# EAGLE design LazuriteMiniDongle3 (EAGLE 7.6.0)
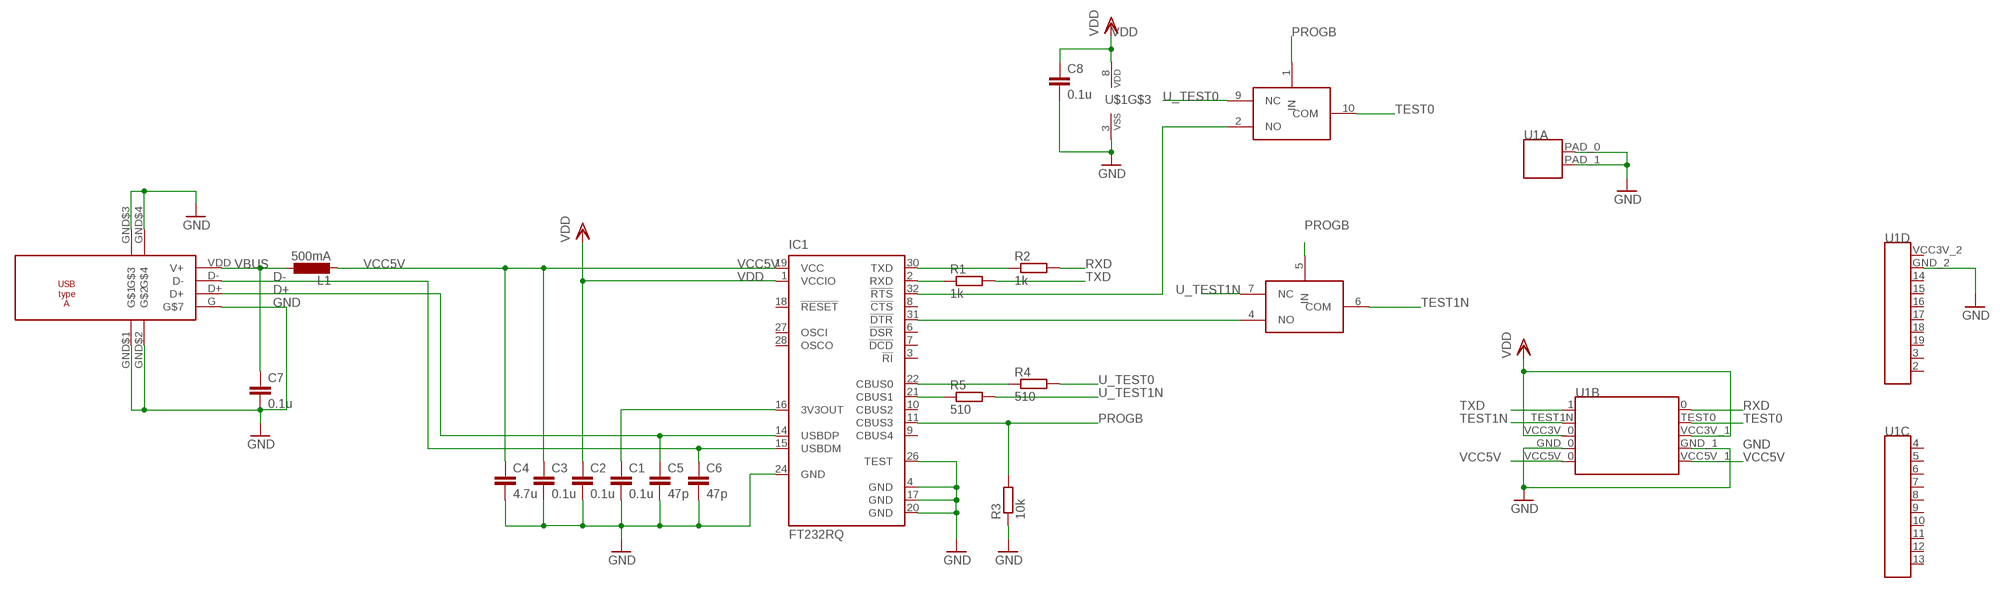
[diagram p0: schematic, sheet 1]

## Parts
C1  0.1u  C-EUC0402  [C0402]
C2  0.1u  C-EUC0402  [C0402]
C3  0.1u  C-EUC0402  [C0402]
C4  4.7u  C-EUC1608  [C1608]
C5  47p  C-EUC0402  [C0402]
C6  47p  C-EUC0402  [C0402]
C7  0.1u  C-EUC0402  [C0402]
C8  0.1u  C-EUC0402  [C0402]
IC1  FT232RQ  [QFN32]
L1  500mA  L-EUL1812  [L1812]
R1  1k  R-EU_R0402  [R0402]
R2  1k  R-EU_R0402  [R0402]
R3  10k  R-EU_R0402  [R0402]
R4  510  R-EU_R0402  [R0402]
R5  510  R-EU_R0402  [R0402]
U1  LAZURITE920JLAZURITE920J  [LAZURITE920J]
U$1  TI-TS5A23159  [UQFN10]
U$2  USB-TYPE-A  [UP2-AH-TH]

## Nets
D+: C5.1 IC1.14(USBDP) U$2.D+
D-: C6.1 IC1.15(USBDM) U$2.D-
GND: C1.2 C2.2 C3.2 C4.2 C5.2 C6.2 C7.2 C8.2 IC1.4(GND) IC1.17(GND) IC1.20(GND) IC1.24(GND) IC1.26(TEST) R3.1 U1.GND_0(B:GND_0) U1.GND_1(B:GND_1) U1.GND_2(D:GND_2) U1.PAD_0(A:PAD_0) U1.PAD_1(A:PAD_1) U$1.3(VSS) U$2.G(G$7) U$2.GND$1(G$1) U$2.GND$2(G$2) U$2.GND$3(G$3) U$2.GND$4(G$4)
N$1: C1.1 IC1.16(3V3OUT)
N$3: IC1.32(!RTS) U$1.2(NO)
N$5: IC1.2(RXD) R1.1
N$6: IC1.30(TXD) R2.1
N$7: IC1.21(CBUS1) R5.1
N$8: IC1.22(CBUS0) R4.1
N$9: IC1.31(!DTR) U$1.4(NO)
PROGB: IC1.11(CBUS3) R3.2 U$1.1(IN) U$1.5(IN)
RXD: R2.2 U1.0
TEST0: U1.TEST0(B:TEST0) U$1.10(COM)
TEST1N: U1.TEST1N(B:TEST1N) U$1.6(COM)
TXD: R1.2 U1.1
U_TEST0: R4.2 U$1.9(NC)
U_TEST1N: R5.2 U$1.7(NC)
VBUS: C7.1 L1.1 U$2.VDD(V+)
VCC5V: C3.1 C4.1 IC1.19(VCC) L1.2 U1.VCC5V_0(B:VCC5V_0) U1.VCC5V_1(B:VCC5V_1)
VDD: C2.1 C8.1 IC1.1(VCCIO) U1.VCC3V_0(B:VCC3V_0) U1.VCC3V_1(B:VCC3V_1) U$1.8(VDD)
Unconnected: IC1.3(!RI) IC1.6(!DSR) IC1.7(!DCD) IC1.8(!CTS) IC1.9(CBUS4) IC1.10(CBUS2) IC1.18(!RESET) IC1.27(OSCI) IC1.28(OSCO) U1.2 U1.3 U1.4 U1.5 U1.6 U1.7 U1.8 U1.9 U1.10 U1.11 U1.12 U1.13 U1.14 U1.15 U1.16 U1.17 U1.18 U1.19 U1.VCC3V_2(D:VCC3V_2)

## Library data of the parts
C1-C3 C5-C8 = rcl:C-EU: CAPACITOR, European symbol
C4 = resistor:C-EU: CAPACITOR, European symbol
IC1 = ftdichip:FT232R: Source: http://www.ftdichip.com/Documents/DataSheets/DS_FT232R_v104.pdf; MPN: FT232RQ; OC_FARNELL: 1146033; OC_NEWARK: 91K9919
L1 = rcl:L-EU: INDUCTOR, European symbol
R1-R5 = rcl:R-EU_: RESISTOR, European symbol
U1 = lazurite:LAZURITE920J: Lazurite 920J
U$1 = lz-shield:TI-TS5A23159
U$2 = lz-shield:USB-TYPE-A

## Board
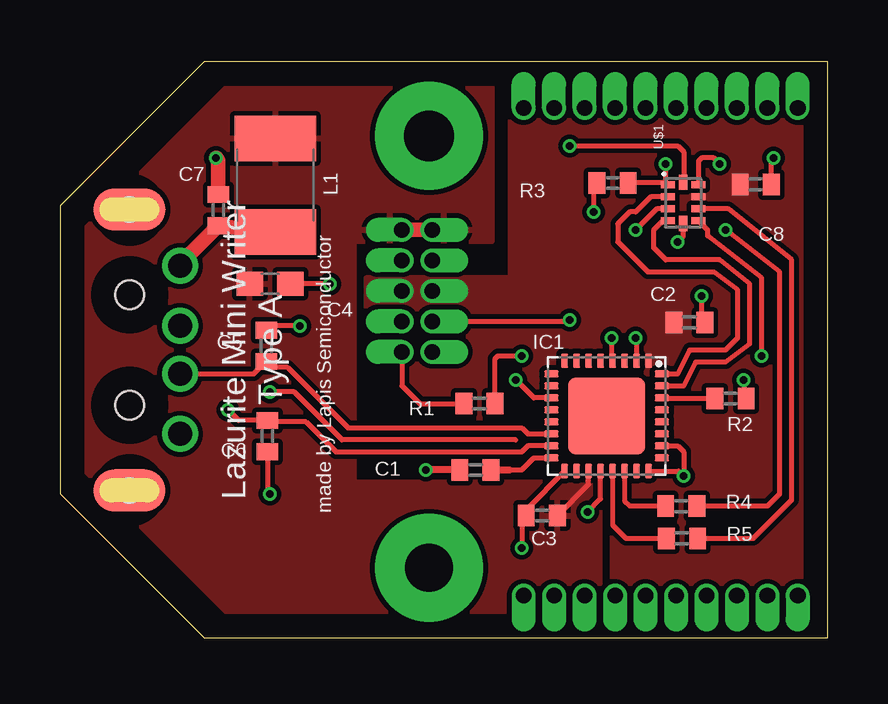
[diagram p1: board, top side]
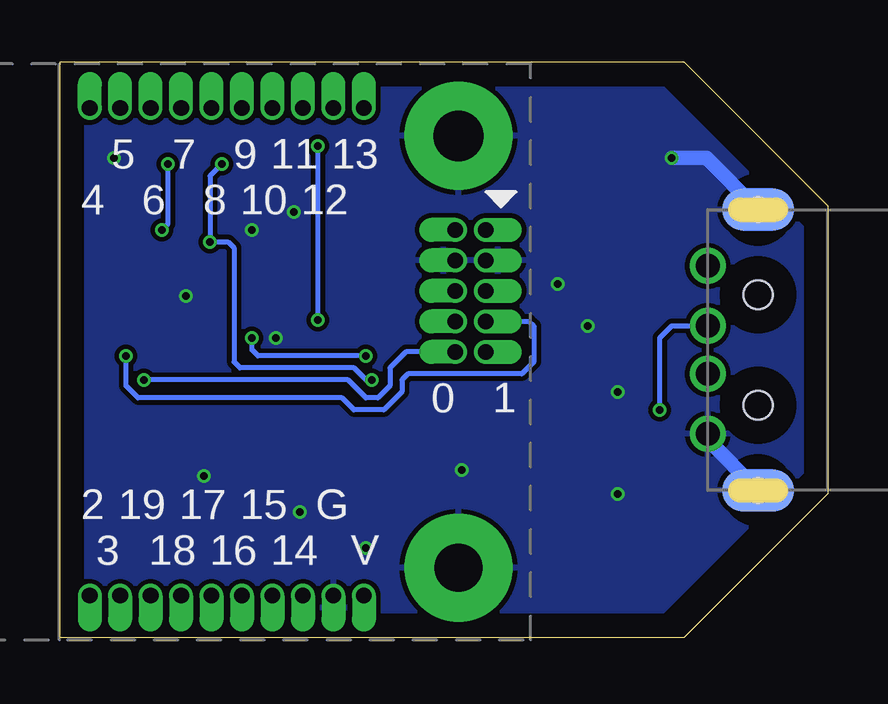
[diagram p2: board, bottom side, seen from below]

Size 32 x 24 mm. Coordinates in mm from the lower left corner, seen from the top.
Outline: 6,0 32,0 32,24 6,24 0,18 0,6 6,0
Copper layers (1*16): Top 0.018mm / dielectric 1.55mm / Bottom 0.018mm
Design rules "kpl_2_layer *": minimum track width 0.2mm, minimum drill 0.3mm, track to track 0.2mm, track to pad 0.2mm, pad to pad 0.2mm, via to via 0.2mm, smd to smd 0mil, copper to edge 1mm, drill to drill 0.3mm, minimum pad ring 0.175mm, minimum via ring 0.125mm, stop-mask expansion 0mil, vias tented up to drill 0.45mm, thermal gap 0.2mm

### Footprints (pad centres in the part's own frame; a part is rotated, then mirrored left to right if it is on the bottom)
C0402 = smd 0.7 x 0.9: 1 -0.65,0; 2 0.65,0
C1608 = smd 1.1 x 1: 1 -0.85,0; 2 0.85,0
QFN32 = smd 0.6 x 0.3: 1 -2.3,1.75; 2 -2.3,1.25; 3 -2.3,0.75; 4 -2.3,0.25; 5 -2.3,-0.25; 6 -2.3,-0.75; 7 -2.3,-1.25; 8 -2.3,-1.75; 17 2.3,-1.75; 18 2.3,-1.25; 19 2.3,-0.75; 20 2.3,-0.25; 21 2.3,0.25; 22 2.3,0.75; 23 2.3,1.25; 24 2.3,1.75 | smd 0.3 x 0.6: 9 -1.75,-2.3; 10 -1.25,-2.3; 11 -0.75,-2.3; 12 -0.25,-2.3; 13 0.25,-2.3; 14 0.75,-2.3; 15 1.25,-2.3; 16 1.75,-2.3; 25 1.75,2.3; 26 1.25,2.3; 27 0.75,2.3; 28 0.25,2.3; 29 -0.25,2.3; 30 -0.75,2.3; 31 -1.25,2.3; 32 -1.75,2.3 | smd 3.2 x 3.2: EXP 0,0
L1812 = smd 1.9 x 3.4: 1 -1.95,0; 2 1.95,0
R0402 = smd 0.7 x 0.9: 1 -0.65,0; 2 0.65,0
LAZURITE920J = drill 0.65 pad 0.8 offset: 0 1.27,5.08; 1 0,5.08; 2 16.51,15.24; 3 15.24,15.24; 4 16.51,-5.08; 5 15.24,-5.08; 6 13.97,-5.08; 7 12.7,-5.08; 8 11.43,-5.08; 9 10.16,-5.08; 10 8.89,-5.08; 11 7.62,-5.08; 12 6.35,-5.08; 13 5.08,-5.08; 14 7.62,15.24; 15 8.89,15.24; 16 10.16,15.24; 17 11.43,15.24; 18 12.7,15.24; 19 13.97,15.24; GND_0 0,1.27; GND_1 1.27,1.27; GND_2 6.35,15.24; TEST0 1.27,3.81; TEST1N 0,3.81; VCC3V_0 0,2.54; VCC3V_1 1.27,2.54; VCC3V_2 5.08,15.24; VCC5V_0 0,0; VCC5V_1 1.27,0 | drill 2.1 pad 4.5: PAD_0 1.135,-3.92 | drill 2 pad 4.5: PAD_1 1.135,14.08
UQFN10 = smd 0.3 x 0.58: 1 -0.75,-0.635; 2 -0.25,-0.635; 3 0.25,-0.635; 4 0.75,-0.635; 6 0.75,0.635; 7 0.25,0.635; 8 -0.25,0.635; 9 -0.75,0.635 | smd 0.63 x 0.35: 5 0.86,0; 10 -0.86,0
UP2-AH-TH = drill 1: D+ -1,5; D- 1,5; G -3.5,5; VDD 3.5,5 | smd 1.75 x 3: GND$1 -5.85,2.9; GND$4 5.85,2.9 | smd 1.75 x 3 bottom: GND$2 -5.85,2.9; GND$3 5.85,2.9 | hole 1.2: -2.3,2.9; 2.3,2.9 | hole 1: -5.85,2.9; 5.85,2.9

### Placement (x,y rotation side)
C1  17.32,7 180 top
C2  26.24,13.15 0 top
C3  20.09,5.1 180 top
C4  8.76,14.75 0 top
C5  8.6,12.17 90 top
C6  8.65,8.41 270 top
C7  6.6,17.83 90 top
C8  29,18.9 0 top
IC1  22.79,9.25 270 top
L1  8.98,18.86 90 top
R1  17.49,9.77 180 top
R2  27.95,9.98 0 top
R3  23.04,18.96 0 top
R4  25.9,5.49 0 top
R5  25.93,4.15 0 top
U1  14.25,17 180 bottom
U$1  25.98,18.13 270 top
U$2  0,12 90 bottom

### Tracks (layer width: path | path; a pad name or v marks a point on that pad's centre or on a via)
D+
  Top 0.2: U$2.D+ 8.08,11 C5.1 8.6,11.27 9.48,11.27 12,8.75 19.25,8.75 19.5,8.5 IC1.14
D-  (via drill 0.3)
  Top 0.2: v7,9.5 7.44,9.06 C6.1 8.71,9 10.25,9 11.5,7.75 19.25,7.75 19.5,8 IC1.15
  Bottom 0.2: v7,9.5 7,12.5 6.5,13 U$2.D-
GND  (via drill 0.3)  (2 unrouted)
  Top 0.2: v11.25,14.75 C4.2 | v10,13 8.78,13 C5.2 | C6.2 8.65,6.1 v8.75,6 | C8.2 29.65,19.9 v29.75,20 | U$1.3 24.88,17.88 v24,17 | v22.25,17.75 22.25,18.82 R3.1 | IC1.4 23,11.59 v23,12.5 | 21,6.91 IC1.17 19.44,5.35 C3.2 19.25,4.91 v19.25,3.75 | IC1.24 25.8,6.95 v26,6.75 26,7.75 25.75,8 IC1.26 | C2.2 26.75,13.29 v26.75,14.25 | 19,8.25 11.75,8.25 9.75,10.25 v8.75,10.25 | v22,5.25 22.54,5.79 IC1.20
  Top 0.3: C1.2 v15.25,7
  Top 0.6: C7.2 6.6,19.9 v6.5,20
  Bottom 0.6: U$2.GND$2 5,8.25 U$2.G | U$2.GND$4 5.05,20 v6.5,20
  pour Bottom: 7,1 31,1 31,23 7,23 1,17 1,7
N$1
  Top 0.2: 18.75,7 19.25,7 19.75,7.5 IC1.16
  Top 0.3: C1.1 18.75,7
N$3
  Top 0.2: IC1.32 25.75,11 26.25,12 27.75,12 28.25,12.5 28.25,14.5 27.25,15.25 24.5,15.25 23.25,16.5 23.25,17.25 23.75,17.75 24,17.75 24.63,18.38 U$1.2
N$5  (via drill 0.3)
  Top 0.2: v24,12.5 24.04,12.46 IC1.2 | R1.1 18.14,11.64 18.25,11.75 v19.25,11.75
  Bottom 0.2: v19.25,11.75 23.75,11.75 24,12 v24,12.5
N$6
  Top 0.2: IC1.30 25.11,9.98 R2.1
N$7
  Top 0.2: IC1.21 23.04,4.71 23.6,4.15 R5.1
N$8
  Top 0.2: IC1.22 23.54,5.71 23.75,5.5 R4.1
N$9
  Top 0.2: IC1.31 26,10.5 26.5,11.5 27.75,11.5 28.75,12.25 28.75,14.75 27.5,15.75 25.25,15.75 24.75,16.25 24.75,17 25.13,17.38 U$1.4
PROGB  (via drill 0.3)
  Top 0.2: v25.75,16.5 25.98,16.73 U$1.5 | R3.2 25.27,18.96 U$1.1 25.25,18.98 v25.25,19.75 | IC1.11 19.75,10 v19,10.75
  Bottom 0.2: v25.25,19.75 25.75,19.25 v25.75,16.5 25,16.5 24.75,16.25 24.75,11.5 24.5,11.25 19.75,11.25 19.25,10.75 v19,10.75
RXD  (via drill 0.3)
  Top 0.2: v28.5,10.75 28.5,10.08 R2.2
  Bottom 0.2: U1.0 17.58,11.92 18.25,11.25 18.25,10.5 18.75,10 19.25,10 20,10.75 v28.5,10.75
TEST0  (via drill 0.3)
  Top 0.2: v21.25,20.5 25.75,20.5 26,20.25 26,19.01 U$1.10 | U1.TEST0 21.19,13.19 v21.25,13.25
  Bottom 0.2: v21.25,13.25 v21.25,20.5
TEST1N  (via drill 0.3)
  Top 0.2: U$1.6 27,17 27,16.75 29.25,15 v29.25,11.75
  Bottom 0.2: U1.TEST1N 12.44,13.19 12.25,13 12.25,11.5 12.75,11 17.5,11 17.75,10.75 17.75,10.25 18.5,9.5 19.75,9.5 20.25,10 28.75,10 29.25,10.5 v29.25,11.75
TXD
  Top 0.2: U1.1 14.25,10.5 15,9.75 16.82,9.75 R1.2
U_TEST0  (via drill 0.3)
  Top 0.2: v27.5,19.75 27.25,20 26.75,20 26.61,19.86 U$1.9 | v27.75,17 30,15.25 30,6 29.5,5.5 R4.2
  Bottom 0.2: v27.75,17 27.5,17.25 v27.5,19.75
U_TEST1N
  Top 0.2: U$1.7 27.87,17.88 30.5,15.75 30.5,5.75 28.9,4.15 R5.2
VBUS
  Top 0.6: U$2.VDD 5,15.58 C7.1 L1.1
VCC5V
  Top 0.2: C3.1 22.04,6.4 IC1.19
  Top 0.6: U1.VCC5V_1 U1.VCC5V_0
  pour Top: 18,23 18,16.5 12.25,16.5 12.25,6.5 22.5,6.5 22.5,1 7,1 1,7 1,17 7,23
VDD
  pour Top (no thermals): 31,0 31,24 18.75,24 18.75,15 12.75,15 12.75,7 23,7 23,0

### Text on the board
tPlace: Lazurite Mini Writer / Type A | made by Lapis Semiconductor